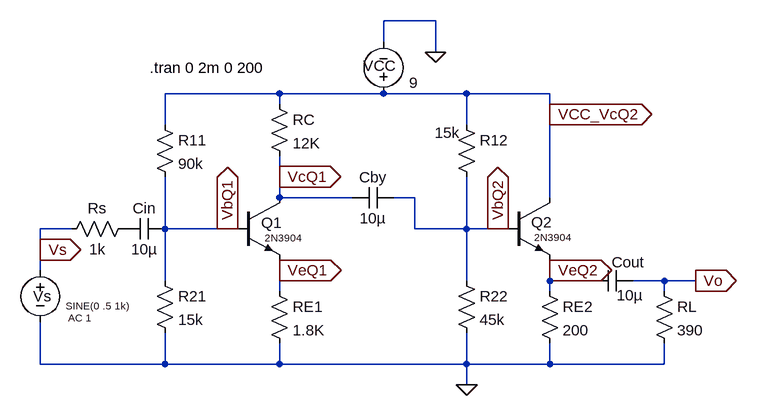
[diagram p0: schematic assigned_schematic_sim01.asc]
assigned_schematic_sim01.asc, the LTspice schematic file:
Version 4
SHEET 1 936 680
WIRE 416 -160 336 -160
WIRE 336 -128 336 -160
WIRE 416 -112 416 -160
WIRE 176 -48 0 -48
WIRE 336 -48 176 -48
WIRE 464 -48 336 -48
WIRE 592 -48 464 -48
WIRE 176 -32 176 -48
WIRE 592 -16 592 -48
WIRE 0 0 0 -48
WIRE 464 0 464 -48
WIRE 176 80 176 48
WIRE 176 112 176 80
WIRE 288 112 176 112
WIRE 384 112 352 112
WIRE 592 112 592 -16
WIRE -144 160 -192 160
WIRE 0 160 0 80
WIRE 96 160 0 160
WIRE 112 160 96 160
WIRE 384 160 384 112
WIRE 464 160 464 80
WIRE 464 160 384 160
WIRE 512 160 464 160
WIRE 528 160 512 160
WIRE -192 192 -192 160
WIRE -192 224 -192 192
WIRE 176 224 176 208
WIRE 592 224 592 208
WIRE 0 240 0 160
WIRE 464 240 464 160
WIRE 592 240 592 224
WIRE 656 240 592 240
WIRE 768 240 720 240
WIRE 816 240 768 240
WIRE 176 256 176 224
WIRE 592 256 592 240
WIRE 768 256 768 240
WIRE -192 368 -192 304
WIRE 0 368 0 320
WIRE 0 368 -192 368
WIRE 176 368 176 336
WIRE 176 368 0 368
WIRE 464 368 464 320
WIRE 464 368 176 368
WIRE 592 368 592 336
WIRE 592 368 464 368
WIRE 768 368 768 336
WIRE 768 368 592 368
WIRE 464 400 464 368
FLAG 416 -112 0
FLAG 464 400 0
FLAG 816 240 Vo
IOPIN 816 240 Out
FLAG 592 -16 VCC_VcQ2
IOPIN 592 -16 Out
FLAG 512 160 VbQ2
IOPIN 512 160 Out
FLAG 96 160 VbQ1
IOPIN 96 160 Out
FLAG 176 224 VeQ1
IOPIN 176 224 Out
FLAG 176 80 VcQ1
IOPIN 176 80 Out
FLAG 592 224 VeQ2
IOPIN 592 224 Out
FLAG -192 192 Vs
IOPIN -192 192 Out
SYMBOL npn 112 112 R0
WINDOW 0 36 39 Left 2
WINDOW 3 41 62 Left 1
SYMATTR InstName Q1
SYMATTR Value 2N3904
SYMBOL npn 528 112 R0
WINDOW 0 35 38 Left 2
WINDOW 3 40 61 Left 1
SYMATTR InstName Q2
SYMATTR Value 2N3904
SYMBOL cap 352 96 R90
WINDOW 0 0 32 VBottom 2
WINDOW 3 32 32 VTop 2
SYMATTR InstName Cby
SYMATTR Value 10µ
SYMBOL res -16 -16 R0
SYMATTR InstName R11
SYMATTR Value 90k
SYMBOL res -16 224 R0
SYMATTR InstName R21
SYMATTR Value 15k
SYMBOL res 448 -16 R0
WINDOW 3 -33 28 Left 2
SYMATTR Value 15k
SYMATTR InstName R12
SYMBOL res 448 224 R0
SYMATTR InstName R22
SYMATTR Value 45k
SYMBOL res 160 -48 R0
SYMATTR InstName RC
SYMATTR Value 12K
SYMBOL res 160 240 R0
SYMATTR InstName RE1
SYMATTR Value 1.8K
SYMBOL res 576 240 R0
SYMATTR InstName RE2
SYMATTR Value 200
SYMBOL res 752 240 R0
SYMATTR InstName RL
SYMATTR Value 390
SYMBOL voltage 336 -32 R180
WINDOW 0 -19 59 Left 2
WINDOW 3 -53 33 Left 2
WINDOW 123 0 0 Left 0
WINDOW 39 0 0 Left 0
SYMATTR InstName VCC
SYMATTR Value 9
SYMBOL voltage -192 208 R0
WINDOW 0 -11 56 Left 2
WINDOW 3 39 70 Left 1
WINDOW 123 43 89 Left 1
WINDOW 39 0 0 Left 0
SYMATTR InstName Vs
SYMATTR Value SINE(0 .5 1k)
SYMATTR Value2 AC 1
SYMBOL cap 720 224 R90
WINDOW 0 3 7 VBottom 2
WINDOW 3 23 5 VTop 2
SYMATTR InstName Cout
SYMATTR Value 10µ
SYMBOL cap 0 144 R90
WINDOW 0 0 32 VBottom 2
WINDOW 3 32 32 VTop 2
SYMATTR InstName Cin
SYMATTR Value 10µ
SYMBOL res -48 144 R90
WINDOW 0 0 56 VBottom 2
WINDOW 3 32 56 VTop 2
SYMATTR InstName Rs
SYMATTR Value 1k
TEXT -24 -88 Left 2 !.tran 0 2m 0 200

The netlist it stands for:
* assigned_schematic_sim01.asc
Q1 VcQ1 VbQ1 VeQ1 0 2N3904
Q2 VCC_VcQ2 VbQ2 VeQ2 0 2N3904
Cby VbQ2 VcQ1 10µ
R11 VCC_VcQ2 VbQ1 90k
R21 VbQ1 0 15k
R12 VCC_VcQ2 VbQ2 15k
R22 VbQ2 0 45k
RC VCC_VcQ2 VcQ1 12K
RE1 VeQ1 0 1.8K
RE2 VeQ2 0 200
RL Vo 0 390
VCC VCC_VcQ2 0 9
Vs Vs 0 SINE(0 .5 1k) AC 1
Cout Vo VeQ2 10µ
Cin VbQ1 P001 10µ
Rs P001 Vs 1k
.model NPN NPN
.model PNP PNP
.lib standard.bjt
.tran 0 2m 0 200
.backanno
.end